# EAGLE design cpu-tiny85 (EAGLE 7.6.0)
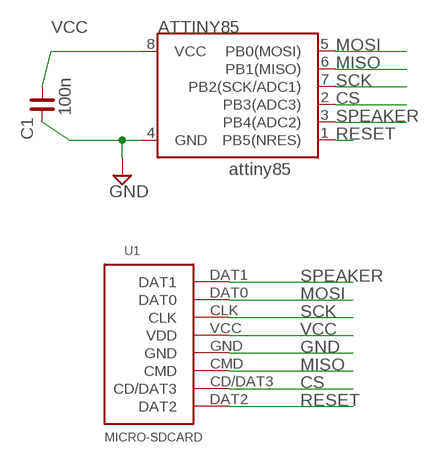
[diagram p0: schematic, sheet 1]

## Parts
ATTINY85  ATTINY45  [SO08-EIAJ]
C1  100n  C_0603  [C0603]
U1  MICRO-SDCARD  [MICRO-SDCARD]

## Nets
CS: ATTINY85.2(PB3(ADC3)) U1.CD/DAT3
GND: ATTINY85.4(GND) C1.2 U1.GND
MISO: ATTINY85.6(PB1(MISO)) U1.CMD
MOSI: ATTINY85.5(PB0(MOSI)) U1.DAT0
RESET: ATTINY85.1(PB5(NRES)) U1.DAT2
SCK: ATTINY85.7(PB2(SCK/ADC1)) U1.CLK
SPEAKER: ATTINY85.3(PB4(ADC2)) U1.DAT1
VCC: ATTINY85.8(VCC) C1.1 U1.VCC(VDD)

## Notes on the sheet
- attiny85

## Library data of the parts
ATTINY85 = SparkFun:ATTINY45: Atmel ATTiny45
C1 = rc-master-smd:C_: NON-POLARIZED CAP
U1 = SparkFun:MICRO-SDCARD

## Net classes
0 default: width 0.203 mm, drill 0.356 mm, clearance 0.203 mm
1 GND: width 0.254 mm, drill 0.356 mm, clearance 0.254 mm

## Board
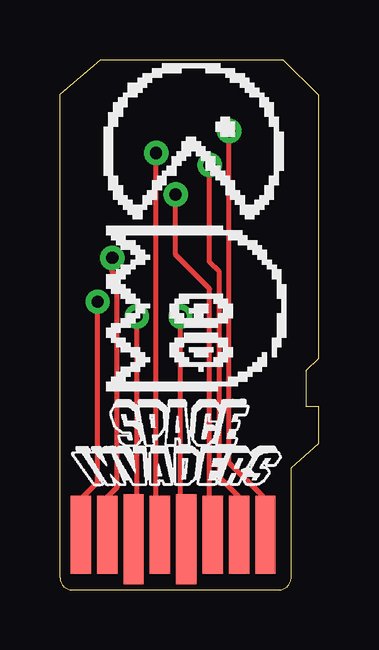
[diagram p1: board, top side]
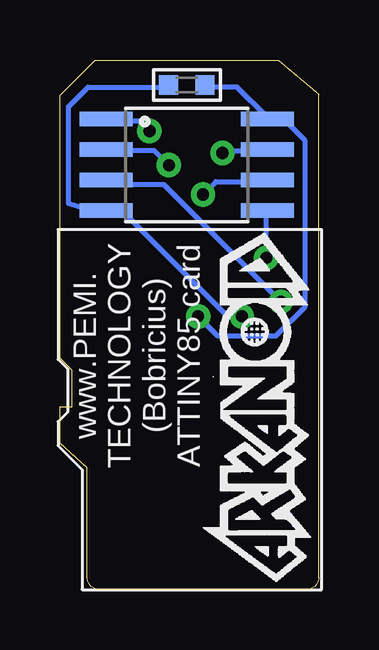
[diagram p2: board, bottom side, seen from below]

Size 10.79 x 22.07 mm. Coordinates in mm from the lower left corner, seen from the top.
Outline: 9.65,0.51 9.65,5.08 10.79,6.1 10.79,7.62 10.29,7.62 10.29,9.14 10.79,9.65 10.79,20.6 9.32,22.07 1.68,22.07 0,20.64 0,0.51 arc90 0.51,0 9.14,0 arc90 9.65,0.51
Copper layers (1*16): Top 0.035mm / dielectric 1.5mm / Bottom 0.035mm
Design rules "SparkFun": minimum track width 8mil, minimum drill 20mil, track to track 8mil, track to pad 8mil, pad to pad 8mil, via to via 8mil, smd to smd 8mil, copper to edge 9mil, drill to drill 8mil, minimum pad ring 12mil, minimum via ring 10mil, stop-mask expansion 4mil, vias tented up to drill 20mil, thermal gap 10mil
vRestrict: area -2.2,0 to 13.2,10.8

### Footprints (pad centres in the part's own frame; a part is rotated, then mirrored left to right if it is on the bottom)
SO08-EIAJ = smd 0.61 x 2.21: 1 -1.905,-3.378; 2 -0.635,-3.378; 3 0.635,-3.378; 4 1.905,-3.378; 5 1.905,3.353; 6 0.635,3.353; 7 -0.635,3.353; 8 -1.905,3.353
C0603 = smd 0.8 x 0.8: 1 -0.762,0; 2 0.762,0
MICRO-SDCARD = smd 0.85 x 3.25 bottom: CD/DAT3 2.56,2.3; CLK 5.86,2.3; CMD 3.66,2.3; DAT0 8.06,2.3; DAT1 9.16,2.3; DAT2 1.46,2.3 | smd 0.85 x 3.75 bottom: GND 6.96,2.1; VCC 4.76,2.1

### Placement (x,y rotation side)
ATTINY85  5.5,17.7 270 bottom
C1  5.5,21.03 180 bottom
U1  10.03,0 0 bottom

### Tracks (layer width: path | path; a pad name or v marks a point on that pad's centre or on a via)
CS  (via drill 0.51)
  Top 0.203: v6.25,17.69 6.25,13.65 6.65,13.25 6.65,4.69 7.47,3.87 7.47,2.45 U1.CD/DAT3
  Bottom 0.203: v6.25,17.69 6.86,18.3 8.69,18.3 ATTINY85.2
GND  (via drill 0.51)
  Top 0.203: v3.2,11.39 3.2,2.25 U1.GND
  Bottom 0.203: C1.2 6.45,20.94 9.63,20.94 10.44,20.13 10.44,16.09 9.7,15.86 8.89,15.86 ATTINY85.4 8.69,15.66 8.08,15.66 3.81,11.39 v3.2,11.39
MISO  (via drill 0.51)
  Top 0.203: v4.83,16.47 4.83,13.96 6.25,12.54 6.25,2.45 U1.CMD
  Bottom 0.203: v4.83,16.47 4.29,17.01 2.06,17.01 ATTINY85.6
MOSI  (via drill 0.51)
  Top 0.203: v2.18,13.83 2.18,13.25 2.39,13.04 2.39,4.28 1.98,3.87 1.98,2.45 U1.DAT0
  Bottom 0.203: v2.18,13.83 2.18,15.66 ATTINY85.5
RESET  (via drill 0.51)
  Top 0.203: v7.06,19.11 7.06,5.3 8.48,3.87 8.48,2.45 U1.DAT2
  Bottom 0.203: v7.06,19.11 7.47,19.52 8.69,19.52 ATTINY85.1
SCK  (via drill 0.51)
  Top 0.203: v4.01,18.2 4.01,2.45 U1.CLK
  Bottom 0.203: v4.01,18.2 3.66,18.3 2.18,18.3 ATTINY85.7
SPEAKER  (via drill 0.51)
  Top 0.203: v1.57,12 1.57,4.48 0.97,3.87 0.97,2.45 U1.DAT1
  Bottom 0.203: v1.57,12 6.45,16.88 8.69,16.88 ATTINY85.3
VCC  (via drill 0.51)
  Top 0.203: v5.03,11.39 5.03,2.45 5.23,2.25 U1.VCC
  Bottom 0.203: C1.1 4.62,20.94 3.4,20.94 2.18,19.72 ATTINY85.8 1.98,19.52 1.37,19.52 0.56,18.71 0.56,11.8 1.78,10.58 4.22,10.58 v5.03,11.39

### Text on the board
bNames: www.PEMI. / TECHNOLOGY / (Bobricius) / ATTINY85 card